# Altium project TO-247-4_MOSFET_Card.PrjPcb
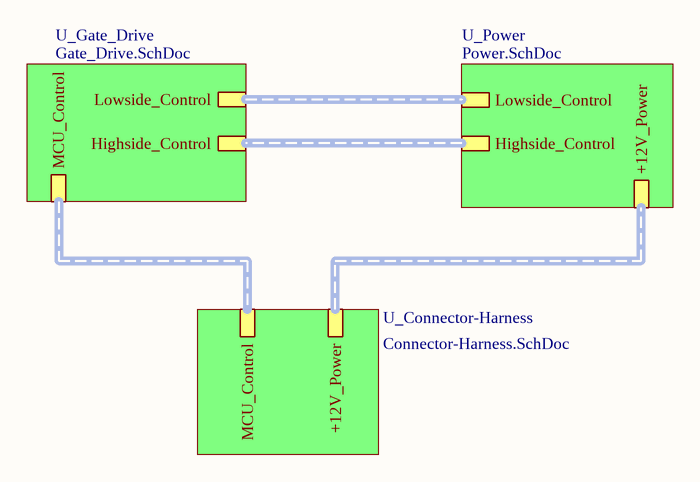
[diagram p0: Main.SchDoc]
4 sheets, 66 parts. Net scope: hierarchical (ports join the sheet entries above them; power ports are global).
Board file: Mosfet_Card.PcbDoc
Sheets:
  Main.SchDoc
    U_Connector-Harness = Connector-Harness.SchDoc
    U_Gate_Drive = Gate_Drive.SchDoc
    U_Power = Power.SchDoc

## Sheet Main.SchDoc
size A4; SheetNumber: 1; SheetTotal: 4

### Sub-sheets
U_Connector-Harness = Connector-Harness.SchDoc: +12V_Power (harness +12V_Power), MCU_Control (harness MCU_Signals)
U_Gate_Drive = Gate_Drive.SchDoc: Lowside_Control (harness Gate_Signals), Highside_Control (harness Gate_Signals), MCU_Control (harness MCU_Signals)
U_Power = Power.SchDoc: Lowside_Control (harness Gate_Signals), Highside_Control (harness Gate_Signals), +12V_Power (harness +12V_Power)

### Buses and harness runs
harness sheet U_Connector-Harness/+12V_Power = sheet U_Power/+12V_Power
harness sheet U_Connector-Harness/MCU_Control = sheet U_Gate_Drive/MCU_Control
harness sheet U_Gate_Drive/Highside_Control = sheet U_Power/Highside_Control
harness sheet U_Gate_Drive/Lowside_Control = sheet U_Power/Lowside_Control

## Sheet Connector-Harness.SchDoc
size A4; SheetNumber: 4; SheetTotal: 4
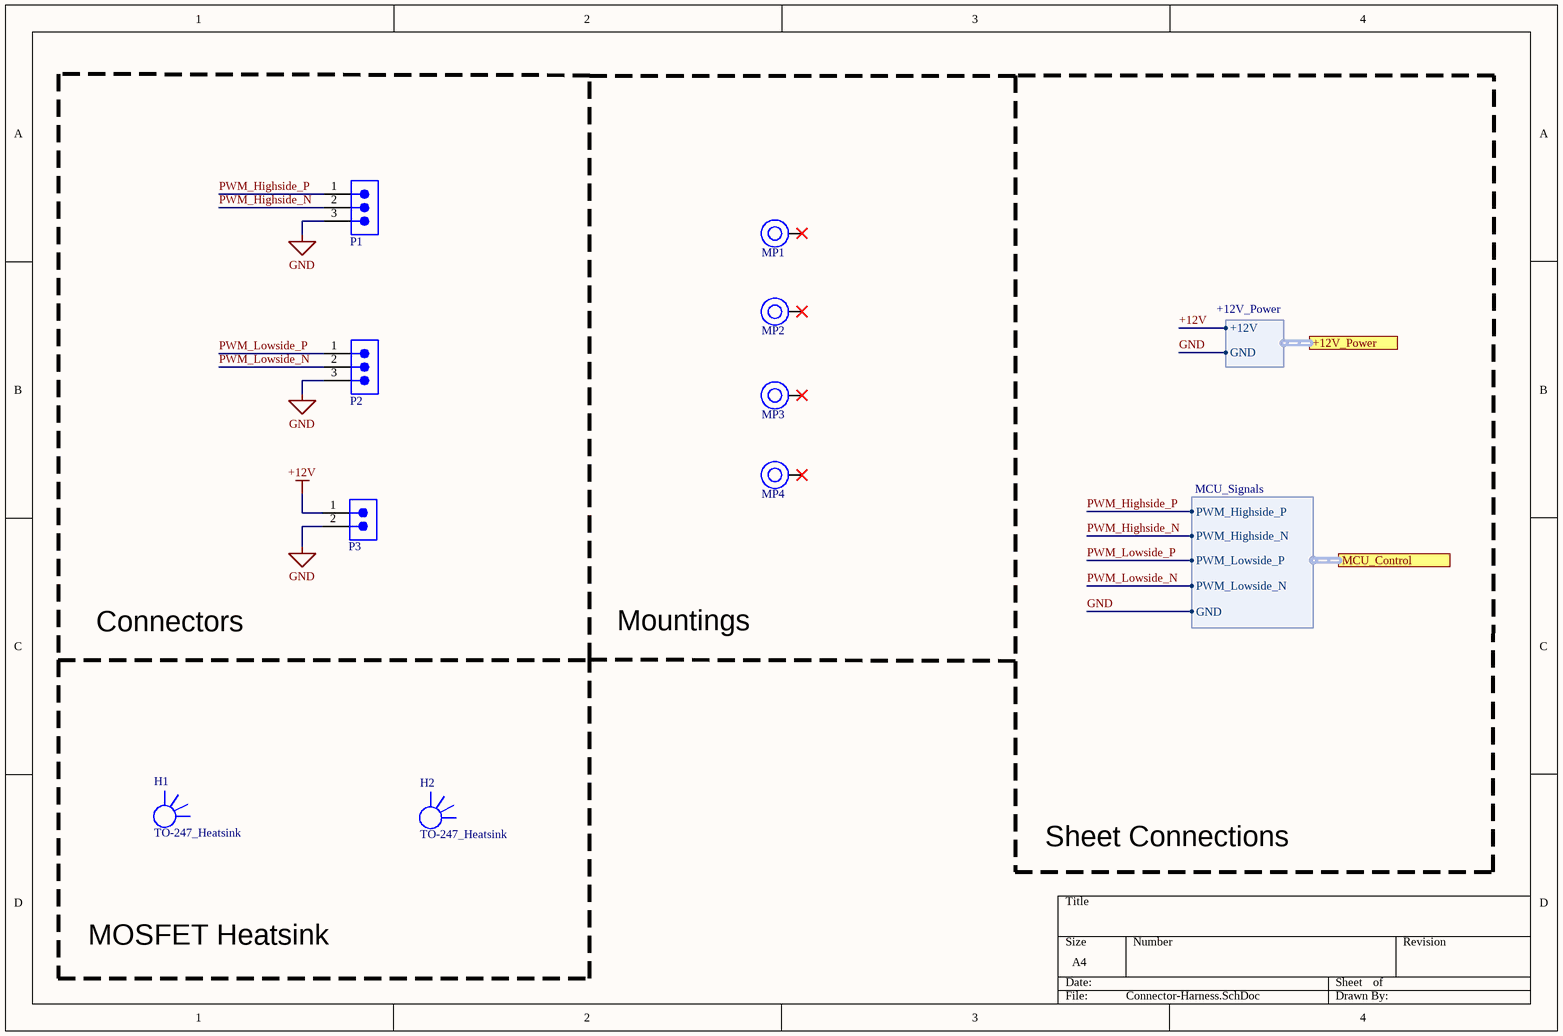
[diagram p1: Connector-Harness.SchDoc]

### Parts
H1  TO-247_Heatsink  [Heatsink]
H2  TO-247_Heatsink  [Heatsink]
MP1  Hole 3.3mm x 9mm  [78614090960]  (value not drawn)
MP2  Hole 3.3mm x 9mm  [78614090960]  (value not drawn)
MP3  Hole 3.3mm x 9mm  [78614090960]  (value not drawn)
MP4  Hole 3.3mm x 9mm  [78614090960]  (value not drawn)
P1  61900311121  [61900311121]  (value not drawn)
P2  61900311121  [61900311121]  (value not drawn)
P3  61900211121  [61900211121]  (value not drawn)

### Blocks framed on the sheet
Connectors: P1-P3

### Ports
+12V_Power (harness +12V_Power), MCU_Control (harness MCU_Signals)

### Harnesses
+12V_Power: +12V, GND
MCU_Signals: PWM_Highside_P, PWM_Highside_N, PWM_Lowside_P, PWM_Lowside_N, GND

### Nets
+12V: P3.1 ; port +12V_Power.+12V
GND: P1.3 P2.3 P3.2 ; port +12V_Power.GND, port MCU_Control.GND
PWM_Highside_N: P1.2 ; port MCU_Control.PWM_Highside_N
PWM_Highside_P: P1.1 ; port MCU_Control.PWM_Highside_P
PWM_Lowside_N: P2.2 ; port MCU_Control.PWM_Lowside_N
PWM_Lowside_P: P2.1 ; port MCU_Control.PWM_Lowside_P

Not connected (* = marked no-connect by the designer): MP1 1*; MP2 1*; MP3 1*; MP4 1*

### Notes on the sheet
- Mountings
- Sheet Connections
- MOSFET Heatsink

### Library data of the parts
MP1-MP4 = 78614090960: WA-SMSA SMT Spacer Studs Automotive, OD 6mm, ID 4.2mm, Hole 3.3mm x 9mm; Manufacturer: Wurth Elektronik; Surface: Tin; Solder Cream Thickness Min: 150um; Manufacturer Part Number: 78614090960; Category: SMT Spacers; Match Code: WA-SMSA; ComponentLink1Description: Website Link; ComponentLink1URL: https://www.we-online.com/redexpert/article/78614090960?ad; ComponentLink2Description: Datasheet Link; ComponentLink2URL: https://www.we-online.com/redexpert/spec/78614090960?ad; Mount: Surface Mount; Operating Temperature Max: 150°C; Operating Temperature Min: -55°C; Packaging: Tape and Reel; Height: 9mm; Automotive: Yes; Inside Diameter: 4.2mm; Hole Diameter: 3.3mm; Material: Steel; Outside Diameter: 6mm
P1 P2 = 61900311121: WR-WTB THT Male Vertical Locking Header, pitch 2.54mm, 3pins; Manufacturer: Wurth Elektronik; Contact Resistance: 20mOhm; Rated Current: 3A; Working Voltage: 250VAC; Withstanding Voltage: 1000VAC; Manufacturer Part Number: 61900311121; Category: Wire-to-Board Connectors; Match Code: WR-WTB; ComponentLink1Description: Website Link; ComponentLink1URL: https://www.we-online.com/redexpert/article/61900311121?ad; ComponentLink2Description: Datasheet Link; ComponentLink2URL: https://www.we-online.com/redexpert/spec/61900311121?ad; Mount: Through Hole; Operating Temperature Max: 105°C; Operating Temperature Min: -40°C; Packaging: Bag; Length: 7.62mm; Width: 5.8mm; Height: 11.5mm; Gender: Male; Number of Pins: 3; Number of Rows: 1; Orientation: Vertical; Pitch: 2.54mm
P3 = 61900211121: WR-WTB THT Male Vertical Locking Header, pitch 2.54mm, 2pins; Manufacturer: Wurth Elektronik; Contact Resistance: 20mOhm; Rated Current: 3A; Working Voltage: 250VAC; Withstanding Voltage: 1000VAC; Manufacturer Part Number: 61900211121; Category: Wire-to-Board Connectors; Match Code: WR-WTB; ComponentLink1Description: Website Link; ComponentLink1URL: https://www.we-online.com/redexpert/article/61900211121?ad; ComponentLink2Description: Datasheet Link; ComponentLink2URL: https://www.we-online.com/redexpert/spec/61900211121?ad; Mount: Through Hole; Operating Temperature Max: 105°C; Operating Temperature Min: -40°C; Packaging: Bag; Length: 5.08mm; Width: 5.8mm; Height: 11.5mm; Gender: Male; Number of Pins: 2; Number of Rows: 1; Orientation: Vertical; Pitch: 2.54mm

## Sheet Gate_Drive.SchDoc
size A4; SheetNumber: 3; SheetTotal: 4
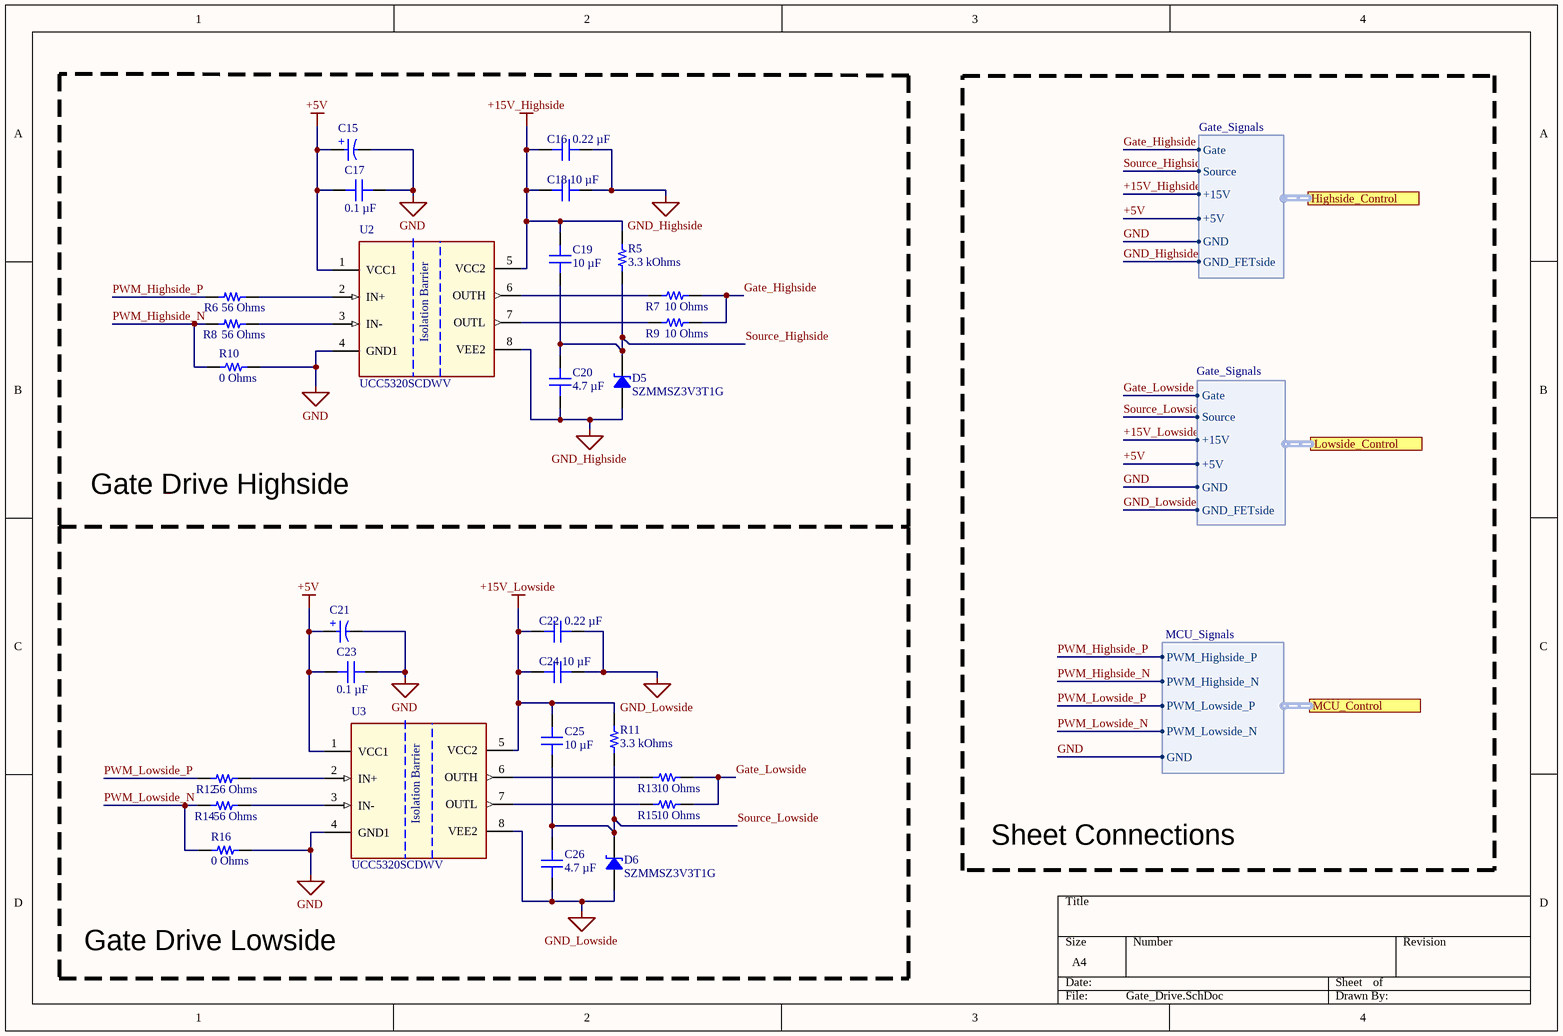
[diagram p2: Gate_Drive.SchDoc]

### Parts
C15  1uF  [WCAP-ATG5_D5H11]  (value not drawn)
C16  0.22 µF  [CAP 0805_2012]
C17  0.1 µF  [CAP 0805_2012]
C18  10 µF  [CAP 0805_2012]
C19  10 µF  [CAP 0805_2012]
C20  4.7 µF  [CAP 0805_2012]
C21  1uF  [WCAP-ATG5_D5H11]  (value not drawn)
C22  0.22 µF  [CAP 0805_2012]
C23  0.1 µF  [CAP 0805_2012]
C24  10 µF  [CAP 0805_2012]
C25  10 µF  [CAP 0805_2012]
C26  4.7 µF  [CAP 0805_2012]
D5  SZMMSZ3V3T1G  [SOD-123]
D6  SZMMSZ3V3T1G  [SOD-123]
R5  3.3 kOhms  [RES 0805_2012]
R6  56 Ohms  [RES 0805_2012]
R7  10 Ohms  [RES 0805_2012]
R8  56 Ohms  [RES 0805_2012]
R9  10 Ohms  [RES 0805_2012]
R10  0 Ohms  [RES 0805_2012]
R11  3.3 kOhms  [RES 0805_2012]
R12  56 Ohms  [RES 0805_2012]
R13  10 Ohms  [RES 0805_2012]
R14  56 Ohms  [RES 0805_2012]
R15  10 Ohms  [RES 0805_2012]
R16  0 Ohms  [RES 0805_2012]
U2  UCC5320SCDWV  [DWV0008A]
U3  UCC5320SCDWV  [DWV0008A]

### Blocks framed on the sheet
Gate Drive Highside: C15-C20 D5 R5-R10 U2

### Ports
Highside_Control (harness Gate_Signals), Lowside_Control (harness Gate_Signals), MCU_Control (harness MCU_Signals)

### Harnesses
Gate_Signals: Gate, Source, +15V, +5V, GND, GND_FETside
MCU_Signals: PWM_Highside_P, PWM_Highside_N, PWM_Lowside_P, PWM_Lowside_N, GND

### Nets
+5V: C15.1(P) C17.1 C21.1(P) C23.1 U2.1(VCC1) U3.1(VCC1) ; port Lowside_Control.+5V, port Highside_Control.+5V
+15V_Highside: C16.1 C18.2 C19.2 R5.2 U2.5(VCC2) ; port Highside_Control.+15V
+15V_Lowside: C22.1 C24.2 C25.2 R11.2 U3.5(VCC2) ; port Lowside_Control.+15V
GND: C15.2(N) C17.2 C21.2(N) C23.2 R10.2 R16.2 U2.4(GND1) U3.4(GND1) ; port Lowside_Control.GND, port Highside_Control.GND, port MCU_Control.GND
GND_Highside: C16.2 C18.1 C20.1 D5.1 U2.8(VEE2) ; port Highside_Control.GND_FETside
GND_Lowside: C22.2 C24.1 C26.1 D6.1 U3.8(VEE2) ; port Lowside_Control.GND_FETside
Gate_Highside: R7.2 R9.2 ; port Highside_Control.Gate
Gate_Lowside: R13.2 R15.2 ; port Lowside_Control.Gate
PWM_Highside_N: R8.1 R10.1 ; port MCU_Control.PWM_Highside_N
PWM_Highside_P: R6.1 ; port MCU_Control.PWM_Highside_P
PWM_Lowside_N: R14.1 R16.1 ; port MCU_Control.PWM_Lowside_N
PWM_Lowside_P: R12.1 ; port MCU_Control.PWM_Lowside_P
Source_Highside: C19.1 C20.2 D5.2 R5.1 ; port Highside_Control.Source
Source_Lowside: C25.1 C26.2 D6.2 R11.1 ; port Lowside_Control.Source
NetR6_2: R6.2 U2.2(IN+)
NetR7_1: R7.1 U2.6(OUTH)
NetR8_2: R8.2 U2.3(IN-)
NetR9_1: R9.1 U2.7(OUTL)
NetR12_2: R12.2 U3.2(IN+)
NetR13_1: R13.1 U3.6(OUTH)
NetR14_2: R14.2 U3.3(IN-)
NetR15_1: R15.1 U3.7(OUTL)

### Notes on the sheet
- Sheet Connections
- Gate Drive Lowside
- (in symbol 860020672005) +
- (in symbol UCC5320SCDWV) Isolation Barrier

### Library data of the parts
C15 C21 = 860020672005: WCAP-ATG5 Aluminum Electrolytic Capacitor, Radial, THT, D5 x H11mm, 1µF, 50V; Manufacturer: Wurth Elektronik; Capacitance Tolerance: +/-20%; Dissipation Factor: 10%; Endurance: 2000h; Leakage Current: 3uA; Ripple Current: 13mA; Technical Reference: ATDC110010M050DSPA3B000; Manufacturer Part Number: 860020672005; Category: Aluminum Electrolytic Capacitors; Match Code: WCAP-ATG5; ComponentLink1Description: Website Link; ComponentLink1URL: https://www.we-online.com/redexpert/article/860020672005?ad; ComponentLink2Description: Datasheet Link; ComponentLink2URL: https://www.we-online.com/redexpert/spec/860020672005?ad; Mount: Through Hole; Operating Temperature Max: 105°C; Operating Temperature Min: -40°C; Packaging: Ammo Pack; Height: 11mm; Diameter: 5mm; Capacitance: 1uF; Rated Voltage (DC): 50V
C16 C22 = VJ0805Y224KXXTW1BC: CAP CER 0.22UF 25V X7R 0805; manufacturer: Vishay Vitramon; Tolerance: ±10%; Part Number: VJ0805Y224KXXTW1BC; Value: 0.22 µF; Applications: General Purpose; Capacitance: 0.22 µF; componentlink1description: Datasheet; componentlink1url: https://www.vishay.com/docs/28548/vjw1bcbascomseries.pdf; componentlink2description: DigiKey Link; componentlink2url: https://www.digikey.com/en/products/detail/vishay-vitramon/VJ0805Y224KXXTW1BC/8312077; Device Package: 0805 (2012 Metric); lastupdated: 9.02.2024 20:15:18; Lifecycle Status: Active; Minimum Order: 1; Mounting Type: Surface Mount, MLCC; Operating Temperature: -55°C ~ 125°C; Package / Case: 0805 (2012 Metric); packaging: TapeAndReel; partid: 26430; Part Status: Active; price: 0.04; series: VJ W1BC; Size / Dimension: 0.079" L x 0.049" W (2.00mm x 1.25mm); Supplier 1: DigiKey; Supplier Part Number 1: 720-VJ0805Y224KXXTW1BCCT-ND; Temperature Coefficient: X7R; Thickness (Max): 0.053" (1.35mm); Voltage - Rated: 25V
C17 C23 = VJ0805Y104MXAMR: CAP CER 0.1UF 50V X7R 0805; manufacturer: Vishay Vitramon; Tolerance: ±20%; Part Number: VJ0805Y104MXAMR; Value: 0.1 µF; Applications: General Purpose; Capacitance: 0.1 µF; componentlink1description: Datasheet; componentlink1url: http://www.vishay.com/docs/45199/vjcommercialseries.pdf; componentlink2description: DigiKey Link; componentlink2url: https://www.digikey.com/en/products/detail/vishay-vitramon/VJ0805Y104MXAMR/8311084; Device Package: 0805 (2012 Metric); lastupdated: 9.02.2024 20:15:36; Lifecycle Status: Active; Minimum Order: 1; Mounting Type: Surface Mount, MLCC; Operating Temperature: -55°C ~ 150°C; Package / Case: 0805 (2012 Metric); packaging: TapeAndReel; partid: 14439; Part Status: Active; price: 0.09; series: VJ; Size / Dimension: 0.079" L x 0.049" W (2.00mm x 1.25mm); Supplier 1: DigiKey; Supplier Part Number 1: 720-1755-1-ND; Temperature Coefficient: X7R; Thickness (Max): 0.057" (1.45mm); Voltage - Rated: 50V
C18 C19 C24 C25 = TMK212BC6106MG-T: CAP CER 10UF 25V X6S 0805; manufacturer: Taiyo Yuden; Tolerance: ±20%; Part Number: TMK212BC6106MG-T; Value: 10 µF; Applications: SMPS Filtering; Capacitance: 10 µF; componentlink1description: Datasheet; componentlink1url: https://ds.yuden.co.jp/TYCOMPAS/ut/detail?pn=TMK212BC6106MG-T&u=M; componentlink2description: DigiKey Link; componentlink2url: https://www.digikey.com/en/products/detail/taiyo-yuden/TMK212BC6106MG-T/11675671; Device Package: 0805 (2012 Metric); lastupdated: 9.02.2024 20:15:02; Lifecycle Status: Active; Minimum Order: 1; Mounting Type: Surface Mount, MLCC; Operating Temperature: -55°C ~ 105°C; Package / Case: 0805 (2012 Metric); packaging: TapeAndReel; partid: 31493; Part Status: Active; price: 0.17; series: M; Size / Dimension: 0.079" L x 0.049" W (2.00mm x 1.25mm); Supplier 1: DigiKey; Supplier Part Number 1: 587-TMK212BC6106MG-TCT-ND; Temperature Coefficient: X6S; Thickness (Max): 0.057" (1.45mm); Voltage - Rated: 25V
C20 C26 = VJ0805V475ZXQTW1BC: CAP CER 4.7UF 10V Y5V 0805; manufacturer: Vishay Vitramon; Temperature Coefficient: Y5V (F); Tolerance: -20%, +80%; Part Number: VJ0805V475ZXQTW1BC; Value: 4.7 µF; Applications: General Purpose; Capacitance: 4.7 µF; componentlink1description: Datasheet; componentlink1url: https://www.vishay.com/docs/28548/vjw1bcbascomseries.pdf; componentlink2description: DigiKey Link; componentlink2url: https://www.digikey.com/en/products/detail/vishay-vitramon/VJ0805V475ZXQTW1BC/8310746; Device Package: 0805 (2012 Metric); lastupdated: 9.02.2024 20:15:54; Lifecycle Status: Active; Minimum Order: 1; Mounting Type: Surface Mount, MLCC; Operating Temperature: -25°C ~ 85°C; Package / Case: 0805 (2012 Metric); packaging: TapeAndReel; partid: 7977; Part Status: Active; price: 0.06; series: VJ; Size / Dimension: 0.079" L x 0.049" W (2.00mm x 1.25mm); Supplier 1: DigiKey; Supplier Part Number 1: 720-1738-1-ND; Thickness (Max): 0.053" (1.35mm); Voltage - Rated: 10V
D5 D6 = SZMMSZ3V3T1G: DIODE ZENER 3.3V 500MW SOD123; Manufacturer: ON Semiconductor; Current - Reverse Leakage @ Vr: 5µA @ 1V; Impedance (Max) (Zzt): 95 Ohms; Tolerance: ±5%; Voltage - Forward (Vf) (Max) @ If: 900mV @ 10mA; Part Number: SZMMSZ3V3T1G; ComponentLink1Description: Datasheet; ComponentLink1URL: http://www.onsemi.com/pub/Collateral/MMSZ2V4T1-D.PDF; ComponentLink2Description: DigiKey Link; ComponentLink2URL: http://digikey.com/product-detail/en/on-semiconductor/SZMMSZ3V3T1G/SZMMSZ3V3T1GOSCT-ND/9087911; LastUpdated: 3.06.2024 19:55:41; Lifecycle Status: Active; Minimum Order: 1; Mounting Type: Surface Mount; Operating Temperature: -55°C ~ 150°C; Package / Case: SOD-123; Packaging: TapeAndReel; PartId: 2464; Part Status: Active; Power - Max: 500mW; Price: 0.05; Series: Automotive, AEC-Q101; Supplier 1: DigiKey; Supplier Part Number 1: SZMMSZ3V3T1GOSCT-ND; Supplier Device Package: SOD-123; Voltage - Zener (Nom) (Vz): 3.3V
R5 R11 = CPF0805B3K3E1: RES SMD 3.3K OHM 0.1% 1/10W 0805; Manufacturer: TE Connectivity Passive Product; Power (Watts): 0.1W, 1/10W; Temperature Coefficient: ±25ppm/°C; Part Number: CPF0805B3K3E1; Value: 3.3 kOhms; ComponentLink1Description: Datasheet; ComponentLink1URL: https://www.te.com/commerce/DocumentDelivery/DDEController?Action=srchrtrv&DocNm=1773200&DocType=DS&DocLang=English; ComponentLink2Description: DigiKey Link; ComponentLink2URL: https://www.digikey.com/en/products/detail/te-connectivity-passive-product/CPF0805B3K3E1/2389807; Composition: Thin Film; Device Package: 0805 (2012 Metric); Height - Seated (Max): 0.026" (0.65mm); LastUpdated: 8.02.2024 21:02:11; Lifecycle Status: Active; Minimum Order: 1; Number of Terminations: 2; Operating Temperature: -55°C ~ 155°C; Package / Case: 0805 (2012 Metric); Packaging: TapeAndReel; PartId: 34198; Part Status: Active; Price: 0.12; Resistance: 3.3 kOhms; Series: CPF, Neohm; Size / Dimension: 0.079" L x 0.049" W (2.00mm x 1.25mm); Supplier 1: DigiKey; Supplier Part Number 1: A102339CT-ND; Supplier Device Package: 0805; Tolerance: ±0.1%
R6 R8 R12 R14 = 3430A2F56RTDF: 3430 A2 1% 56R 100PPM 1K RL; Manufacturer: TE Connectivity Passive Product; Power (Watts): 1W; Temperature Coefficient: ±100ppm/°C; Part Number: 3430A2F56RTDF; Value: 56 Ohms; ComponentLink2Description: DigiKey Link; ComponentLink2URL: https://www.digikey.com/en/products/detail/te-connectivity-passive-product/3430A2F56RTDF/17763508; Composition: Thick Film; Device Package: 0805 (2012 Metric); Features: Automotive AEC-Q200; Height - Seated (Max): 0.026" (0.65mm); LastUpdated: 8.02.2024 21:00:05; Lifecycle Status: Active; Minimum Order: 1; Number of Terminations: 2; Operating Temperature: -55°C ~ 155°C; Package / Case: 0805 (2012 Metric); Packaging: TapeAndReel; PartId: 77356; Part Status: Active; Price: 0.02; Ratings: AEC-Q200; Resistance: 56 Ohms; Series: 3430; Size / Dimension: 0.049" L x 0.079" W (1.25mm x 2.00mm); Supplier 1: DigiKey; Supplier Part Number 1: 1712-3430A2F56RTDFCT-ND; Supplier Device Package: 0508; Tolerance: ±1%
R7 R9 R13 R15 = 3430A2F10RTDF: 3430 A2 1% 10R 100PPM 1K RL; Manufacturer: TE Connectivity Passive Product; Power (Watts): 1W; Temperature Coefficient: ±100ppm/°C; Part Number: 3430A2F10RTDF; Value: 10 Ohms; ComponentLink2Description: DigiKey Link; ComponentLink2URL: https://www.digikey.com/en/products/detail/te-connectivity-passive-product/3430A2F10RTDF/17763496; Composition: Thick Film; Device Package: 0805 (2012 Metric); Features: Automotive AEC-Q200; Height - Seated (Max): 0.026" (0.65mm); LastUpdated: 8.02.2024 21:00:12; Lifecycle Status: Active; Minimum Order: 1; Number of Terminations: 2; Operating Temperature: -55°C ~ 155°C; Package / Case: 0805 (2012 Metric); Packaging: TapeAndReel; PartId: 76305; Part Status: Active; Price: 0.02; Ratings: AEC-Q200; Resistance: 10 Ohms; Series: 3430; Size / Dimension: 0.049" L x 0.079" W (1.25mm x 2.00mm); Supplier 1: DigiKey; Supplier Part Number 1: 1712-3430A2F10RTDFCT-ND; Supplier Device Package: 0508; Tolerance: ±1%
R10 R16 = 5106: RES SMD 0 OHM JUMPER 1/2W 0805; Part Number: 5106; Manufacturer: Keystone Electronics; Power (Watts): 0.5W, 1/2W; Value: 0 Ohms; ComponentLink1Description: Datasheet; ComponentLink1URL: http://keyelco.com/userAssets/file/M65p54.pdf; ComponentLink2Description: DigiKey Link; ComponentLink2URL: https://www.digikey.com/en/products/detail/keystone-electronics/5106/5118868; Composition: Metal Element; Device Package: 0805 (2012 Metric); Height - Seated (Max): 0.028" (0.71mm); LastUpdated: 8.02.2024 21:01:27; Lifecycle Status: Active; Minimum Order: 1; Number of Terminations: 2; Package / Case: 0805 (2012 Metric); Packaging: TapeAndReel; PartId: 44373; Part Status: Active; Price: 0.16; Resistance: 0 Ohms; Series: -; Size / Dimension: 0.079" L x 0.049" W (2.00mm x 1.25mm); Supplier 1: DigiKey; Supplier Part Number 1: 36-5106CT-ND; Supplier Device Package: 0805; Tolerance: Jumper
U2 U3 = UCC5320SCDWV: 3k/5kVrms, 2A/2A single-channel isolated gate driver with UVLO referenced to GND or split output 8-SOIC -40 to 125; Manufacturer_Name: Texas Instruments; TYPE: TYPE; RefDes: RefDes; Copyright: Copyright (C) 2025 Ultra Librarian. All rights reserved.; Manufacturer_Part_Number: UCC5320SCDWV; Datasheet: https://www.ti.com/lit/gpn/ucc5320

## Sheet Power.SchDoc
size A4; SheetNumber: 2; SheetTotal: 4
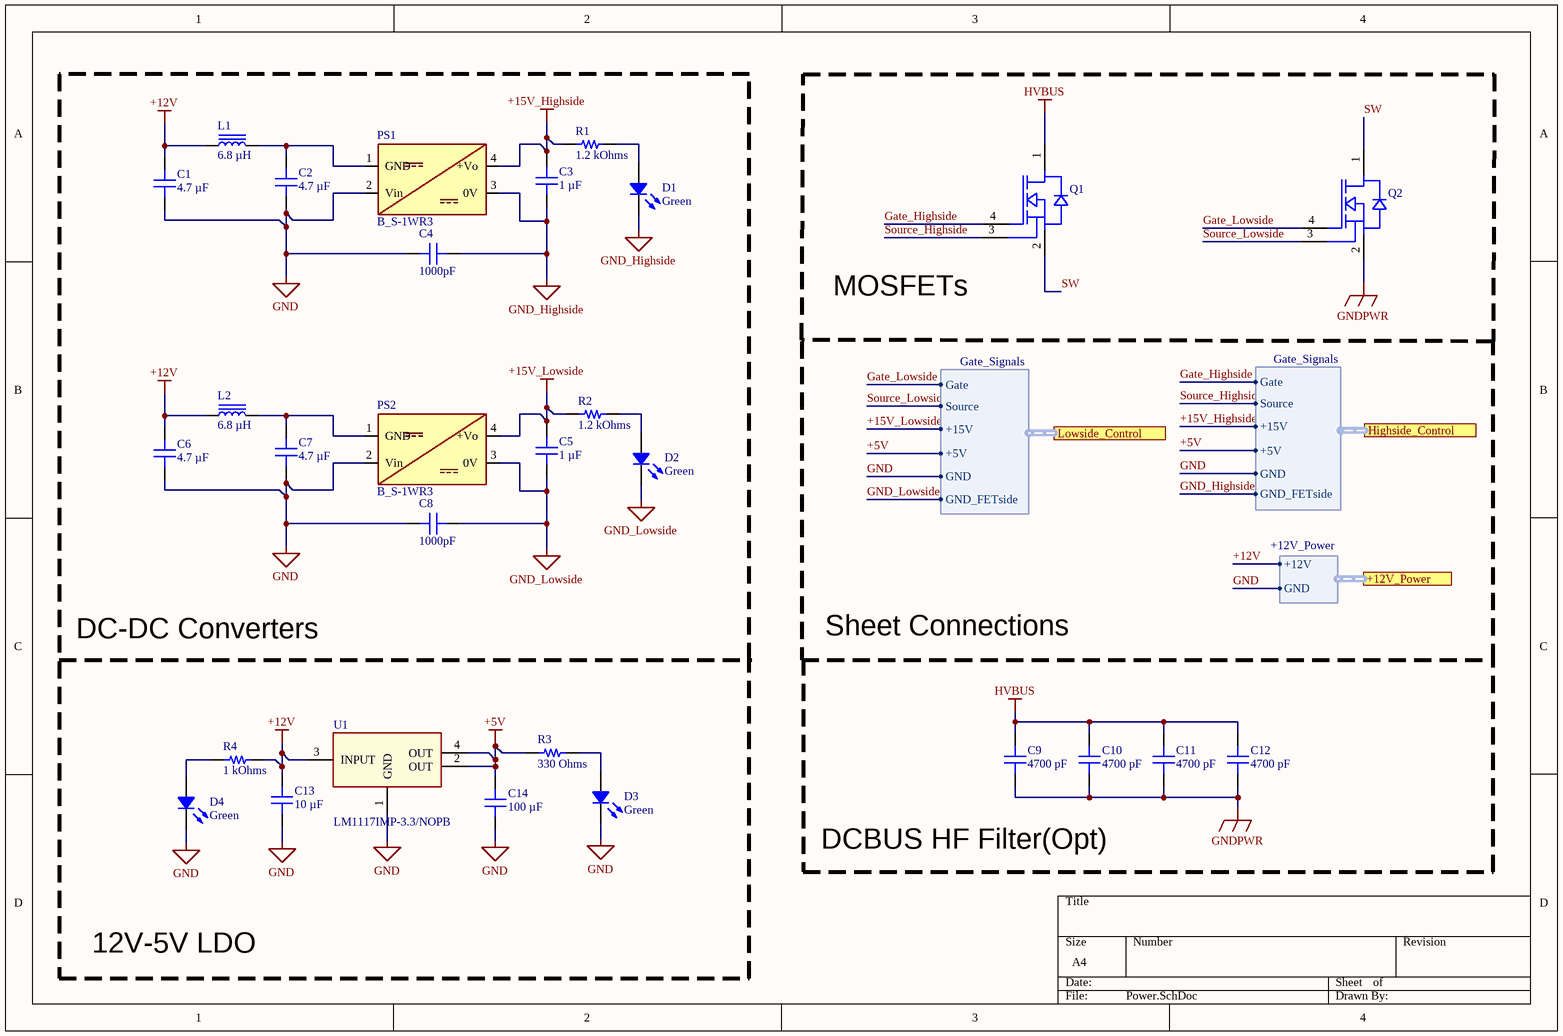
[diagram p3: Power.SchDoc]

### Parts
C1  4.7 µF  [CAP 0805_2012]
C2  4.7 µF  [CAP 0805_2012]
C3  1 µF  [CAP 0805_2012]
C4  1000pF  [CAP 1210_3225 - 1.8MM]
C5  1 µF  [CAP 0805_2012]
C6  4.7 µF  [CAP 0805_2012]
C7  4.7 µF  [CAP 0805_2012]
C8  1000pF  [CAP 1210_3225 - 1.8MM]
C9  4700 pF  [CAP 1206_3216 - 0.8MM]
C10  4700 pF  [CAP 1206_3216 - 0.8MM]
C11  4700 pF  [CAP 1206_3216 - 0.8MM]
C12  4700 pF  [CAP 1206_3216 - 0.8MM]
C13  10 µF  [CAP 0805_2012]
C14  100 µF  [CAP 0805_2012]
D1  Green  [LED 0805_2012 GREEN]
D2  Green  [LED 0805_2012 GREEN]
D3  Green  [LED 0805_2012 GREEN]
D4  Green  [LED 0805_2012 GREEN]
L1  6.8 µH  [TDK VLCF4024-2]
L2  6.8 µH  [TDK VLCF4024-2]
PS1  B_S-1WR3  [B_S-1WR3]
PS2  B_S-1WR3  [B_S-1WR3]
Q1  NTH4L015N065SC1  [NTH4L015N065SC1]  (value not drawn)
Q2  NTH4L015N065SC1  [NTH4L015N065SC1]  (value not drawn)
R1  1.2 kOhms  [RES 0805_2012]
R2  1.2 kOhms  [RES 0805_2012]
R3  330 Ohms  [RES 0805_2012]
R4  1 kOhms  [RES 0805_2012]
U1  LM1117IMP-3.3/NOPB  [DCY0004A_M]

### Blocks framed on the sheet
DC-DC Converters: C1-C8 D1 D2 L1 L2 PS1 PS2 R1 R2
MOSFETs: Q1 Q2

### Ports
+12V_Power (harness +12V_Power), Highside_Control (harness Gate_Signals), Lowside_Control (harness Gate_Signals)

### Harnesses
Gate_Signals: Gate, Source, +15V, +5V, GND, GND_FETside
+12V_Power: +12V, GND

### Nets
+5V: C14.2 R3.1 U1.2(OUT) U1.4(OUT) ; port Lowside_Control.+5V, port Highside_Control.+5V
+12V: C1.2 C6.2 C13.2 L1.1 L2.1 R4.2 U1.3(INPUT) ; port +12V_Power.+12V
+15V_Highside: C3.2 PS1.4(+Vo) R1.1 ; port Highside_Control.+15V
+15V_Lowside: C5.2 PS2.4(+Vo) R2.1 ; port Lowside_Control.+15V
GND: C1.1 C2.1 C4.1 C6.1 C7.1 C8.1 C13.1 C14.1 D3.2 D4.2 PS1.2(Vin) PS2.2(Vin) U1.1(GND) ; port Lowside_Control.GND, port Highside_Control.GND, port +12V_Power.GND
GND_Highside: C3.1 C4.2 D1.2 PS1.3(0V) ; port Highside_Control.GND_FETside
GND_Lowside: C5.1 C8.2 D2.2 PS2.3(0V) ; port Lowside_Control.GND_FETside
GNDPWR: C9.1 C10.1 C11.1 C12.1 Q2.2(S2)
HVBUS: C9.2 C10.2 C11.2 C12.2 Q1.1(D)
Gate_Highside: Q1.4(G) ; port Highside_Control.Gate
Gate_Lowside: Q2.4(G) ; port Lowside_Control.Gate
Source_Highside: Q1.3(S1) ; port Highside_Control.Source
Source_Lowside: Q2.3(S1) ; port Lowside_Control.Source
SW: Q1.2(S2) Q2.1(D)
NetC2_2: C2.2 L1.2 PS1.1(GND)
NetC7_2: C7.2 L2.2 PS2.1(GND)
NetD1_1: D1.1 R1.2
NetD2_1: D2.1 R2.2
NetD3_1: D3.1 R3.2
NetD4_1: D4.1 R4.1

### Notes on the sheet
- Sheet Connections
- DCBUS HF Filter(Opt)
- 12V-5V LDO

### Library data of the parts
C1 C2 C6 C7 = VJ0805V475ZXQTW1BC: as C20 on sheet Gate_Drive; Part Number: VJ0805V475ZXQTW1BC; Value: 4.7 µF; Applications: General Purpose; Capacitance: 4.7 µF; componentlink1description: Datasheet; componentlink1url: https://www.vishay.com/docs/28548/vjw1bcbascomseries.pdf; componentlink2description: DigiKey Link; componentlink2url: https://www.digikey.com/en/products/detail/vishay-vitramon/VJ0805V475ZXQTW1BC/8310746; Device Package: 0805 (2012 Metric); lastupdated: 9.02.2024 20:15:54; Lifecycle Status: Active; Minimum Order: 1; Mounting Type: Surface Mount, MLCC; Operating Temperature: -25°C ~ 85°C; Package / Case: 0805 (2012 Metric); packaging: TapeAndReel; partid: 7977; Part Status: Active; price: 0.06; series: VJ; Size / Dimension: 0.079" L x 0.049" W (2.00mm x 1.25mm); Supplier 1: DigiKey; Supplier Part Number 1: 720-1738-1-ND; Thickness (Max): 0.053" (1.35mm); Voltage - Rated: 10V
C3 C5 = VJ0805Y105KXXTW1BC: CAP CER 1UF 25V X7R 0805; manufacturer: Vishay Vitramon; Tolerance: ±10%; Part Number: VJ0805Y105KXXTW1BC; Value: 1 µF; Applications: General Purpose; Capacitance: 1 µF; componentlink1description: Datasheet; componentlink1url: http://www.vishay.com/docs/28548/vjw1bcbascomseries.pdf; componentlink2description: DigiKey Link; componentlink2url: https://www.digikey.com/en/products/detail/vishay-vitramon/VJ0805Y105KXXTW1BC/9681488; Device Package: 0805 (2012 Metric); lastupdated: 9.02.2024 20:15:32; Lifecycle Status: Active; Minimum Order: 1; Mounting Type: Surface Mount, MLCC; Operating Temperature: -55°C ~ 125°C; Package / Case: 0805 (2012 Metric); packaging: TapeAndReel; partid: 15348; Part Status: Active; price: 0.02; series: VJ W1BC; Size / Dimension: 0.079" L x 0.049" W (2.00mm x 1.25mm); Supplier 1: DigiKey; Supplier Part Number 1: 720-VJ0805Y105KXXTW1BCCT-ND; Temperature Coefficient: X7R; Thickness (Max): 0.053" (1.35mm); Voltage - Rated: 25V
C4 C8 = 1210GC102MAT1A: CAP CER 1000PF 2KV X7R 1210; manufacturer: AVX Corporation; Tolerance: ±20%; Voltage - Rated: 2000V (2kV); Part Number: 1210GC102MAT1A; Value: 1000pF; Applications: General Purpose; Capacitance: 1000pF; componentlink1description: Datasheet; componentlink1url: http://datasheets.avx.com/AVX-HV_MLCC.pdf; componentlink2description: DigiKey Link; componentlink2url: http://digikey.com/product-detail/en/avx-corporation/1210GC102MAT1A/478-5184-1-ND/1913274; Device Package: 1210 (3225 Metric); Features: High Voltage; lastupdated: 2.09.2020 01:10:35; Lifecycle Status: Active; Minimum Order: 1; Mounting Type: Surface Mount, MLCC; Operating Temperature: -55°C ~ 125°C; Package / Case: 1210 (3225 Metric); packaging: TapeAndReel; partid: 24774; Part Status: Active; price: 0.30; series: -; Size / Dimension: 0.130" L x 0.098" W (3.30mm x 2.50mm); Supplier 1: DigiKey; Supplier Part Number 1: 478-5184-1-ND; Temperature Coefficient: X7R; Thickness (Max): 0.071" (1.80mm)
C9-C12 = C1206X472KDRACAUTO: CAP CER 4700PF 1KV X7R 1206; manufacturer: KEMET; Tolerance: ±10%; Voltage - Rated: 1000V (1kV); Part Number: C1206X472KDRACAUTO; Value: 4700 pF; Applications: Automotive, Boardflex Sensitive; Capacitance: 4700 pF; componentlink1description: Datasheet; componentlink1url: https://api.kemet.com/component-edge/download/datasheet/C1206X472KDRACAUTO.pdf; componentlink2description: DigiKey Link; componentlink2url: https://www.digikey.com/en/products/detail/kemet/C1206X472KDRACAUTO/8109916; Device Package: 1206 (3216 Metric); Features: Soft Termination, High Voltage; lastupdated: 4.06.2024 19:10:21; Lifecycle Status: Active; Minimum Order: 1; Mounting Type: Surface Mount, MLCC; Operating Temperature: -55°C ~ 125°C; Package / Case: 1206 (3216 Metric); packaging: TapeAndReel; partid: 19261; Part Status: Active; price: 0.19; Ratings: AEC-Q200; series: SMD Auto X7R HV Flex; Size / Dimension: 0.130" L x 0.063" W (3.30mm x 1.60mm); Supplier 1: DigiKey; Supplier Part Number 1: 399-16735-1-ND; Temperature Coefficient: X7R; Thickness (Max): 0.047" (1.20mm)
C13 = TMK212BC6106MG-T: as C18 on sheet Gate_Drive; Part Number: TMK212BC6106MG-T; Value: 10 µF; Applications: SMPS Filtering; Capacitance: 10 µF; componentlink1description: Datasheet; componentlink1url: https://ds.yuden.co.jp/TYCOMPAS/ut/detail?pn=TMK212BC6106MG-T&u=M; componentlink2description: DigiKey Link; componentlink2url: https://www.digikey.com/en/products/detail/taiyo-yuden/TMK212BC6106MG-T/11675671; Device Package: 0805 (2012 Metric); lastupdated: 9.02.2024 20:15:02; Lifecycle Status: Active; Minimum Order: 1; Mounting Type: Surface Mount, MLCC; Operating Temperature: -55°C ~ 105°C; Package / Case: 0805 (2012 Metric); packaging: TapeAndReel; partid: 31493; Part Status: Active; price: 0.17; series: M; Size / Dimension: 0.079" L x 0.049" W (2.00mm x 1.25mm); Supplier 1: DigiKey; Supplier Part Number 1: 587-TMK212BC6106MG-TCT-ND; Temperature Coefficient: X6S; Thickness (Max): 0.057" (1.45mm); Voltage - Rated: 25V
C14 = MSASJ21GBB5107MTCA01: CAP CER 100UF 6.3V X5R 0805; manufacturer: Taiyo Yuden; Tolerance: ±20%; Part Number: MSASJ21GBB5107MTCA01; Value: 100 µF; Applications: SMPS Filtering; Capacitance: 100 µF; componentlink2description: DigiKey Link; componentlink2url: https://www.digikey.com/en/products/detail/taiyo-yuden/MSASJ21GBB5107MTCA01/16664806; Device Package: 0805 (2012 Metric); lastupdated: 9.02.2024 20:14:44; Lifecycle Status: Active; Minimum Order: 3000; Mounting Type: Surface Mount, MLCC; Operating Temperature: -55°C ~ 85°C; Package / Case: 0805 (2012 Metric); packaging: TapeAndReel; partid: 48730; Part Status: Active; price: 0.52; series: MSAS; Size / Dimension: 0.079" L x 0.049" W (2.00mm x 1.25mm); Supplier 1: DigiKey; Supplier Part Number 1: 587-MSASJ21GBB5107MTCA01TR-ND; Temperature Coefficient: X5R; Thickness (Max): 0.057" (1.45mm); Voltage - Rated: 6.3V
D1-D4 = HSMQ-C170: LED GREEN DIFFUSED CHIP SMD; Manufacturer: Broadcom Limited; Configuration: Standard; Current - Test: 20mA; Lens Color: White; Lens Size: 1.40mm x 1.25mm; Lens Style: Rectangle with Flat Top; Millicandela Rating: 145mcd; Viewing Angle: 140°; Voltage - Forward (Vf) (Typ): 3.4V; Wavelength - Dominant: 527nm; Wavelength - Peak: 520nm; Part Number: HSMQ-C170; Color: Green; ComponentLink1Description: Datasheet; ComponentLink1URL: https://docs.broadcom.com/docs/AV02-0977EN; ComponentLink2Description: DigiKey Link; ComponentLink2URL: https://www.digikey.com/en/products/detail/broadcom-limited/HSMQ-C170/1235197; Device Package: 0805 (2012 Metric); Height (Max): 0.80mm; LastUpdated: 3.06.2024 20:00:29; Lens Transparency: Diffused; Lifecycle Status: Active; Minimum Order: 1; Mounting Type: Surface Mount; Package / Case: 0805 (2012 Metric); Packaging: TapeAndReel; PartId: 256; Part Status: Active; Price: 0.38; Series: -; Size / Dimension: 2.00mm L x 1.25mm W; Supplier 1: DigiKey; Supplier Part Number 1: 516-3071-1-ND; Supplier Device Package: Chip LED; Value: Green
L1 L2 = VLCF4024T-6R8N1R1-2: FIXED IND 6.8UH 1.15A 116MOHM SM; Manufacturer: TDK Corporation; DC Resistance (DCR): 116mOhm Max; Inductance Frequency - Test: 100 kHz; Material - Core: Ferrite; Shielding: Shielded; Tolerance: ±30%; Type: Drum Core, Wirewound; Part Number: VLCF4024T-6R8N1R1-2; ComponentLink1Description: Datasheet; ComponentLink1URL: https://product.tdk.com/info/en/catalog/datasheets/inductor_commercial_power_vlcf4024-2_en.pdf?ref_disty=digikey; ComponentLink2Description: DigiKey Link; ComponentLink2URL: https://www.digikey.com/en/products/detail/tdk-corporation/VLCF4024T-6R8N1R1-2/3083280; Current Rating (Amps): 1.15 A; Current - Saturation: 1.15A; Device Package: Nonstandard; Height - Seated (Max): 0.094" (2.40mm); Inductance: 6.8 µH; LastUpdated: 3.06.2024 20:02:43; Lifecycle Status: Active; Minimum Order: 1; Mounting Type: Surface Mount; Operating Temperature: -40°C ~ 105°C; Package / Case: Nonstandard; Packaging: TapeAndReel; PartId: 160; Part Status: Active; Price: 0.30; Series: VLCF; Size / Dimension: 0.157" L x 0.157" W (4.00mm x 4.00mm); Supplier 1: DigiKey; Supplier Part Number 1: 445-8738-1-ND; Value: 6.8 µH
Q1 Q2 = NTH4L015N065SC1: Max RDS(on) = 18.7 m at Vgs = 18V, Id = 60A; High Junction Temperature; 100% UIL Tested; RoHS Compliant; High Speed Switching and Low Capacitance; 650V rated; Manufacturer_Name: onsemi; Geometry.Height: 25.56mm; Manufacturer_Part_Number: NTH4L015N065SC1; Mouser Part Number: 863-NTH4L015N065SC1; Mouser Price/Stock: https://www.mouser.co.uk/ProductDetail/onsemi/NTH4L015N065SC1?qs=stqOd1AaK7%252BX4HlQwOMOTg%3D%3D; Arrow Part Number: NTH4L015N065SC1; Arrow Price/Stock: https://www.arrow.com/en/products/nth4l015n065sc1/on-semiconductor?region=nac; Datasheet Link: https://www.onsemi.com/pub/Collateral/NTH4L015N065SC1-D.PDF
R1 R2 = CPF0805B1K2E1: RES SMD 1.2K OHM 0.1% 1/10W 0805; Manufacturer: TE Connectivity Passive Product; Power (Watts): 0.1W, 1/10W; Temperature Coefficient: ±25ppm/°C; Part Number: CPF0805B1K2E1; Value: 1.2 kOhms; ComponentLink1Description: Datasheet; ComponentLink1URL: https://www.te.com/commerce/DocumentDelivery/DDEController?Action=srchrtrv&DocNm=1773200&DocType=DS&DocLang=English; ComponentLink2Description: DigiKey Link; ComponentLink2URL: https://www.digikey.com/en/products/detail/te-connectivity-passive-product/CPF0805B1K2E1/2382033; Composition: Thin Film; Device Package: 0805 (2012 Metric); Height - Seated (Max): 0.026" (0.65mm); LastUpdated: 8.02.2024 21:00:58; Lifecycle Status: Active; Minimum Order: 1; Number of Terminations: 2; Operating Temperature: -55°C ~ 155°C; Package / Case: 0805 (2012 Metric); Packaging: TapeAndReel; PartId: 48602; Part Status: Active; Price: 0.12; Resistance: 1.2 kOhms; Series: CPF, Neohm; Size / Dimension: 0.079" L x 0.049" W (2.00mm x 1.25mm); Supplier 1: DigiKey; Supplier Part Number 1: A103167CT-ND; Supplier Device Package: 0805; Tolerance: ±0.1%
R3 = CPF0805B330RE1: RES SMD 330 OHM 0.1% 1/10W 0805; Manufacturer: TE Connectivity Passive Product; Power (Watts): 0.1W, 1/10W; Temperature Coefficient: ±25ppm/°C; Part Number: CPF0805B330RE1; Value: 330 Ohms; ComponentLink1Description: Datasheet; ComponentLink1URL: https://www.te.com/commerce/DocumentDelivery/DDEController?Action=srchrtrv&DocNm=1773200&DocType=DS&DocLang=English; ComponentLink2Description: DigiKey Link; ComponentLink2URL: https://www.digikey.com/en/products/detail/te-connectivity-passive-product/CPF0805B330RE1/2382020; Composition: Thin Film; Device Package: 0805 (2012 Metric); Height - Seated (Max): 0.026" (0.65mm); LastUpdated: 8.02.2024 21:01:14; Lifecycle Status: Active; Minimum Order: 1; Number of Terminations: 2; Operating Temperature: -55°C ~ 155°C; Package / Case: 0805 (2012 Metric); Packaging: TapeAndReel; PartId: 46733; Part Status: Active; Price: 0.12; Resistance: 330 Ohms; Series: CPF, Neohm; Size / Dimension: 0.079" L x 0.049" W (2.00mm x 1.25mm); Supplier 1: DigiKey; Supplier Part Number 1: A103195CT-ND; Supplier Device Package: 0805; Tolerance: ±0.1%
R4 = 1-2176092-8: RES SMD 1K OHM 0.1% 1/4W 0805; Manufacturer: TE Connectivity Passive Product; Power (Watts): 0.25W, 1/4W; Temperature Coefficient: ±25ppm/°C; Part Number: 1-2176092-8; Value: 1 kOhms; ComponentLink1Description: Datasheet; ComponentLink1URL: https://www.te.com/commerce/DocumentDelivery/DDEController?Action=srchrtrv&DocNm=1773272&DocType=DS&DocLang=English; ComponentLink2Description: DigiKey Link; ComponentLink2URL: https://www.digikey.com/en/products/detail/te-connectivity-passive-product/1-2176092-8/4034011; Composition: Thin Film; Device Package: 0805 (2012 Metric); Height - Seated (Max): 0.026" (0.65mm); LastUpdated: 8.02.2024 21:02:35; Lifecycle Status: Active; Minimum Order: 1; Number of Terminations: 2; Operating Temperature: -55°C ~ 155°C; Package / Case: 0805 (2012 Metric); Packaging: TapeAndReel; PartId: 28484; Part Status: Active; Price: 0.14; Resistance: 1 kOhms; Series: RP73P, Holsworthy; Size / Dimension: 0.079" L x 0.049" W (2.00mm x 1.25mm); Supplier 1: DigiKey; Supplier Part Number 1: A110543CT-ND; Supplier Device Package: 0805; Tolerance: ±0.1%
U1 = LM1117IMP-3.3NOPB: 800-mA 15-V linear voltage regulator 4-SOT-223 -40 to 125; Manufacturer_Name: Texas Instruments; TYPE: TYPE; RefDes: RefDes; Copyright: Copyright (C) 2025 Ultra Librarian. All rights reserved.; Manufacturer_Part_Number: LM1117IMP-3.3/NOPB; Datasheet: https://www.ti.com/lit/gpn/lm1117

## Nets that join several sheets
+5V: Gate_Drive (6 pins), Power (C14.2 R3.1 U1.2 U1.4)
+12V: Connector-Harness (P3.1), Power (7 pins)
+15V_Highside: Gate_Drive (5 pins), Power (C3.2 PS1.4 R1.1)
+15V_Lowside: Gate_Drive (5 pins), Power (C5.2 PS2.4 R2.1)
GND: Connector-Harness (P1.3 P2.3 P3.2), Gate_Drive (8 pins), Power (13 pins)
GND_Highside: Gate_Drive (5 pins), Power (C3.1 C4.2 D1.2 PS1.3)
GND_Lowside: Gate_Drive (5 pins), Power (C5.1 C8.2 D2.2 PS2.3)
Gate_Highside: Gate_Drive (R7.2 R9.2), Power (Q1.4)
Gate_Lowside: Gate_Drive (R13.2 R15.2), Power (Q2.4)
PWM_Highside_N: Connector-Harness (P1.2), Gate_Drive (R8.1 R10.1)
PWM_Highside_P: Connector-Harness (P1.1), Gate_Drive (R6.1)
PWM_Lowside_N: Connector-Harness (P2.2), Gate_Drive (R14.1 R16.1)
PWM_Lowside_P: Connector-Harness (P2.1), Gate_Drive (R12.1)
Source_Highside: Gate_Drive (C19.1 C20.2 D5.2 R5.1), Power (Q1.3)
Source_Lowside: Gate_Drive (C25.1 C26.2 D6.2 R11.1), Power (Q2.3)